# EasyEDA schematic SCH_joystick_board_2025-02-11.json
TITLE: joystick board; REV: 1.0; Date: 2025-01-24; Sheet: 1/1; Company: GJK
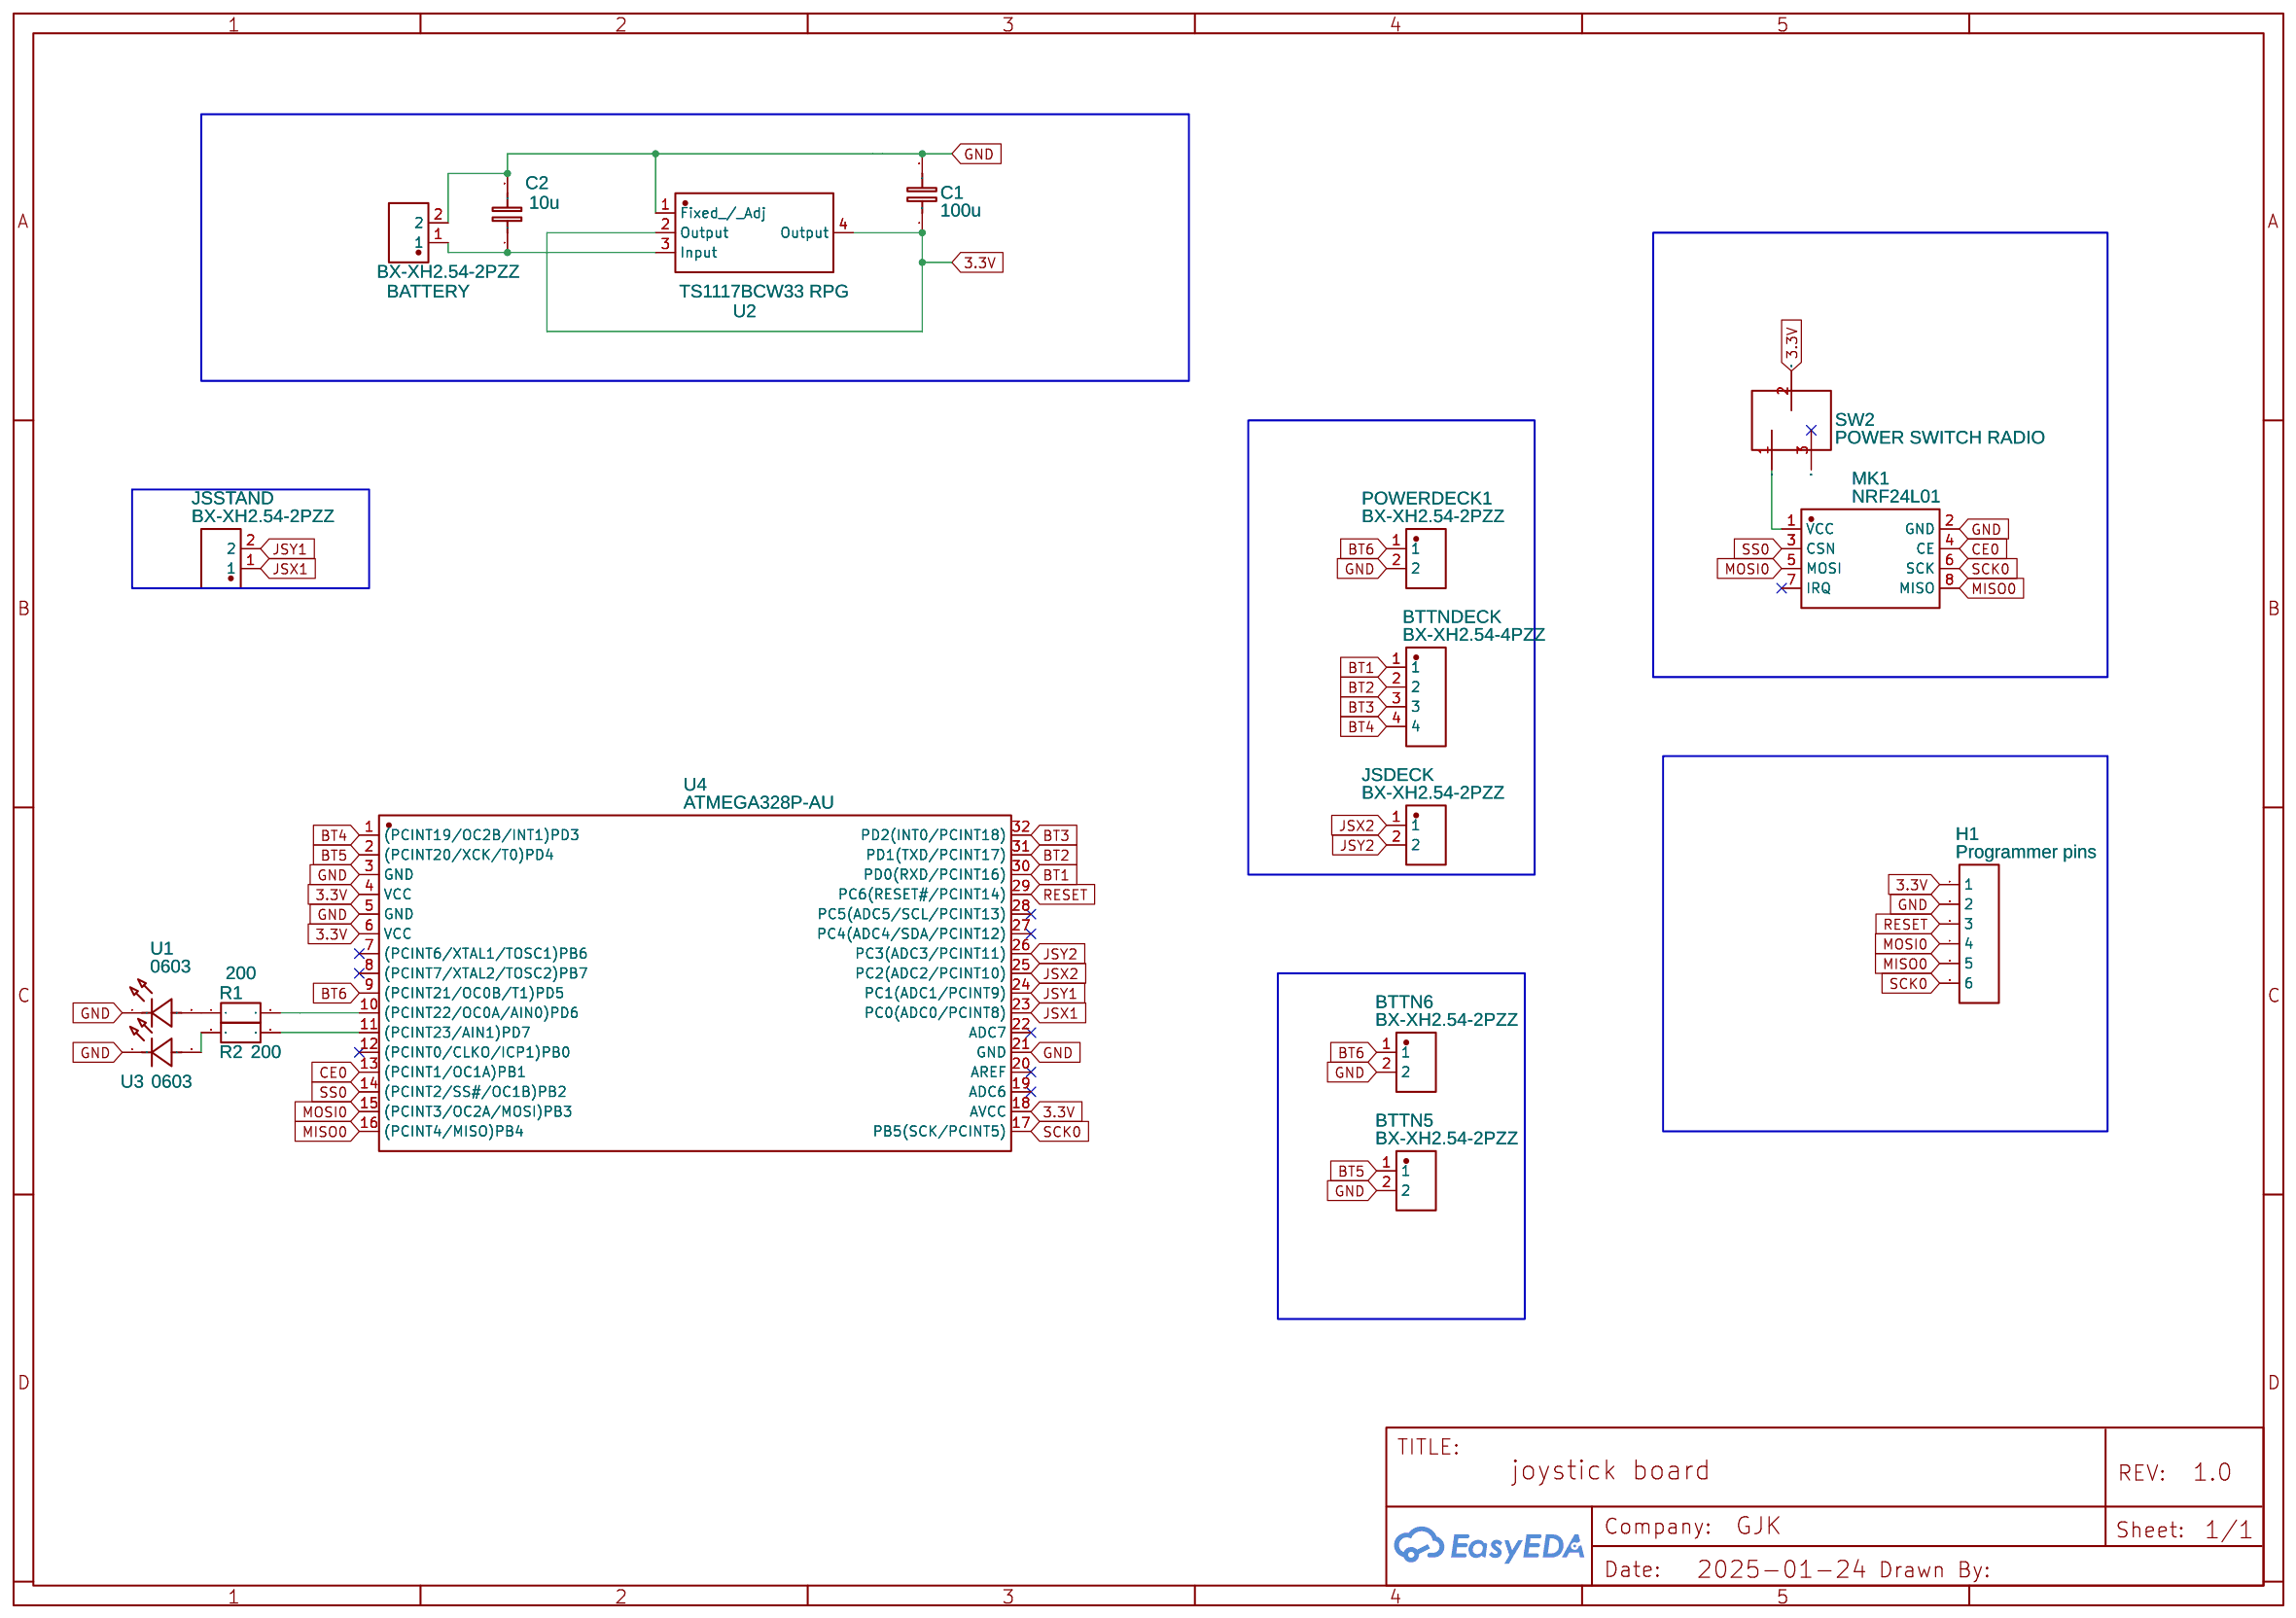
[diagram p0: schematic sheet]

## Parts
BATTERY  BX-XH2.54-2PZZ  [CONN-TH_2P-P2.50_BX-XH2.54-2PZZ]
BTTN5  BX-XH2.54-2PZZ  [CONN-TH_2P-P2.50_BX-XH2.54-2PZZ]
BTTN6  BX-XH2.54-2PZZ  [CONN-TH_2P-P2.50_BX-XH2.54-2PZZ]
BTTNDECK  BX-XH2.54-4PZZ  [CONN-TH_4P-P2.50_BX-XH2.54-4PZZ]
C1  100u  [C0603]
C2  10u  [C0603]
H1  Programmer pins  [HDR-TH_6P-P2.54-V-M-1]
JSDECK  BX-XH2.54-2PZZ  [CONN-TH_2P-P2.50_BX-XH2.54-2PZZ]
JSSTAND  BX-XH2.54-2PZZ  [CONN-TH_2P-P2.50_BX-XH2.54-2PZZ]
MK1  NRF24L01  [WIRELM-SMD_NRF24L01]
POWERDECK1  BX-XH2.54-2PZZ  [CONN-TH_2P-P2.50_BX-XH2.54-2PZZ]
R1  200  [R0603]
R2  200  [R0603]
SW2  POWER SWITCH RADIO  [KLS7-SS02-12F20 (1P2T)]
U1  0603  [LED0603-RD_RED]
U2  TS1117BCW33 RPG  [SOT-223_L6.5-W3.5-P2.30-LS7.0-BR]
U3  0603  [LED0603-RD_RED]
U4  ATMEGA328P-AU  [TQFP-32_L7.0-W7.0-P0.80-LS9.0-BL]

## Library data of the parts
BATTERY BTTN5 BTTN6 JSDECK JSSTAND POWERDECK1 = BX-XH2.54-2PZZ: Supplier: LCSC; Supplier Part: C18077833; Manufacturer: Bossie(博锡); Contributor: lcsc; JLCPCB Part Class: Extended Part
BTTNDECK = BX-XH2.54-4PZZ: Supplier: LCSC; Supplier Part: C18077835; Manufacturer: Bossie(博锡); Contributor: lcsc; JLCPCB Part Class: Extended Part
C1 C2 = C_0603_EU: Contributor: LCEDA_Lib
H1 = Header-Male-2.54_1x6: Supplier: LCSC; Manufacturer: BOOMELE(博穆精密); Manufacturer Part: 2.54-1x6P直针; Supplier Part: C37208; JLCPCB Part Class: Extended Part
MK1 = NRF24L01: Supplier: LCSC; Manufacturer: Ai-Thinker(安信可); Manufacturer Part: NF-04; Supplier Part: C90751; JLCPCB Part Class: Extended Part
R1 R2 = R_0603_EU: Contributor: LCEDA_Lib
SW2 = DIP_SWITCH 3PIN COPY: Supplier: LCSC; Manufacturer: KE; Manufacturer Part: DIP switch 8bit,Dip Switch,DSWB03LHGET; Contributor: Роман Коваль; Supplier Part: C99420
U1 U3 = 0603: Contributor: lcsc; Convert to PCB: Yes; Add into BOM: Yes; Supplier: LCSC; Supplier Part: C9900014602; Manufacturer: null; JLCPCB Part Class: Extended Part
U2 = TS1117BCW33 RPG: Contributor: LCSC; Supplier: LCSC; Supplier Part: C410833; Manufacturer: Taiwan Semiconductor(台湾半导体); JLCPCB Part Class: Extended Part
U4 = ATMEGA328P-AU: Supplier: LCSC; Manufacturer: MICROCHIP(美国微芯); Supplier Part: C14877; JLCPCB Part Class: Extended Part

## Nets
3.3V: C1.1 H1.1 SW2.2(P2) U2.2(Output) U2.4(Output) U4.4(VCC) U4.6(VCC) U4.18(AVCC)
GND: BATTERY.2 BTTN5.2 BTTN6.2 C1.2 C2.2 H1.2 MK1.2(GND) POWERDECK1.2 U1.1(K) U2.1(Fixed / Adj) U3.1(K) U4.3(GND) U4.5(GND) U4.21(GND)
BT1: BTTNDECK.1 U4.30(PD0(RXD/PCINT16))
BT2: BTTNDECK.2 U4.31(PD1(TXD/PCINT17))
BT3: BTTNDECK.3 U4.32(PD2(INT0/PCINT18))
BT4: BTTNDECK.4 U4.1((PCINT19/OC2B/INT1)PD3)
BT5: BTTN5.1 U4.2((PCINT20/XCK/T0)PD4)
BT6: BTTN6.1 POWERDECK1.1 U4.9((PCINT21/OC0B/T1)PD5)
CE0: MK1.4(CE) U4.13((PCINT1/OC1A)PB1)
JSX1: JSSTAND.1 U4.23(PC0(ADC0/PCINT8))
JSX2: JSDECK.1 U4.25(PC2(ADC2/PCINT10))
JSY1: JSSTAND.2 U4.24(PC1(ADC1/PCINT9))
JSY2: JSDECK.2 U4.26(PC3(ADC3/PCINT11))
MISO0: H1.5 MK1.8(MISO) U4.16((PCINT4/MISO)PB4)
MOSI0: H1.4 MK1.5(MOSI) U4.15((PCINT3/OC2A/MOSI)PB3)
RESET: H1.3 U4.29(PC6(RESET#/PCINT14))
SCK0: H1.6 MK1.6(SCK) U4.17(PB5(SCK/PCINT5))
SS0: MK1.3(CSN) U4.14((PCINT2/SS#/OC1B)PB2)
Net-(BATTERY-1): BATTERY.1 C2.1 U2.3(Input)
Net-(MK1-1): MK1.1(VCC) SW2.1(P1)
Net-(R1-1): R1.1 U1.2(A)
Net-(R1-2): R1.2 U4.10((PCINT22/OC0A/AIN0)PD6)
Net-(R2-1): R2.1 U3.2(A)
Net-(R2-2): R2.2 U4.11((PCINT23/AIN1)PD7)

Not connected (* = marked no-connect by the designer): MK1 7(IRQ)*; SW2 3(P3)*; U4 7((PCINT6/XTAL1/TOSC1)PB6)* 8((PCINT7/XTAL2/TOSC2)PB7)* 12((PCINT0/CLKO/ICP1)PB0)* 19(ADC6)* 20(AREF)* 22(ADC7)* 27(PC4(ADC4/SDA/PCINT12))* 28(PC5(ADC5/SCL/PCINT13))*
